# EasyEDA Pro project ProDoc_OHPP-004_Joule_Scope.epro

# Board OHPP-004
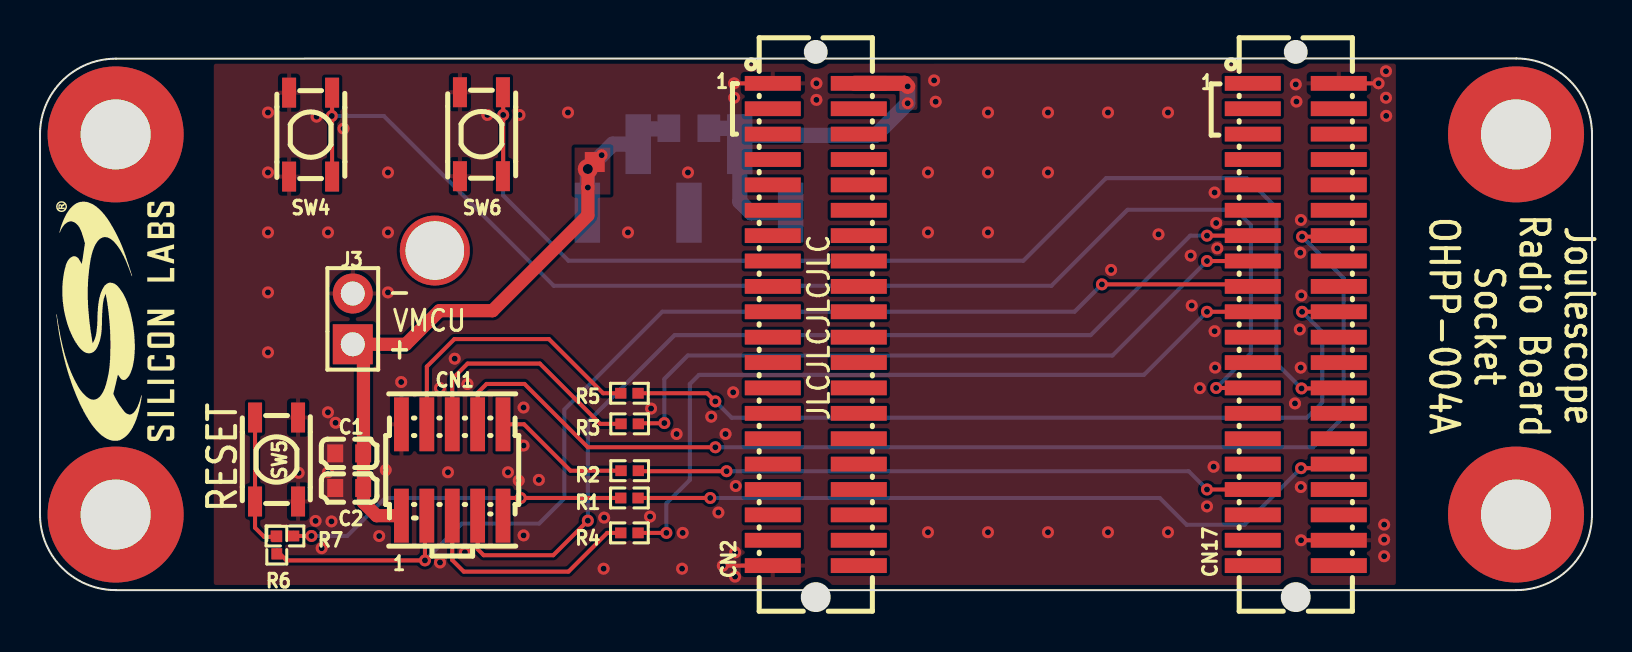
[diagram p0: board, top side]
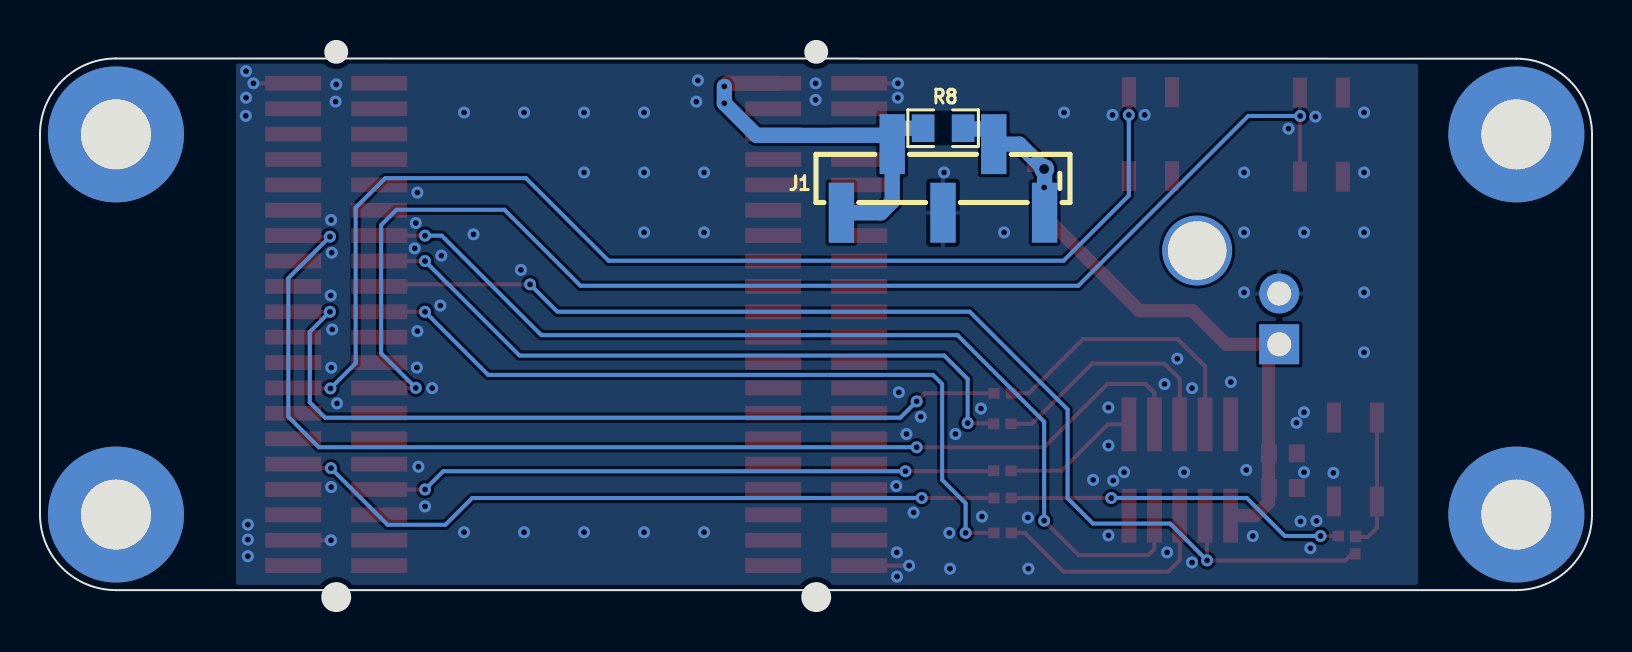
[diagram p1: board, bottom side, seen from below]

Outline 77.6 x 28.62 mm; copper layers: Top Layer, Bottom Layer. Coordinates in mm from the lower left corner of the outline.
Outline path: 0,23.9 0,4.89 arc(1.11,2.21) 3.79,1.1 73.81,1.1 arc(76.49,2.21) 77.6,4.89 77.6,23.91 arc(76.49,26.59) 73.81,27.7 3.79,27.69 arc(1.11,26.58) 0,23.9
Stack: Top Layer 0.035mm / Dielectric1 1.51mm FR4 er 4.5 / Bottom Layer 0.035mm

## Design rules (mm)
template: User Custom Config
spacing safeClearance (default): track to track 0.152, other pairs 0 to 0.3
spacing GND: track to track 0.127, other pairs 0.127 to 0.127
track width trackWidth (default): min 0.203, default 0.203, max 0.762
differential pair differentialPair (default): width min 0.127, default 0.254, max 2.54; gap min 0.152, default 0.152
via viaSize (default): diameter min 0.6, default 0.6, max 1; hole min 0.3, default 0.3, max 0.5
net POWER_GND uses GND
pour ie1304 uses CopperRegion

## Placement (name value [footprint] x y rotation side)
C1  10uF  [C0603]  15.46 7.94 0 top
C2  100nF  [C0603]  15.46 6.2 0 top
CN1  2c2c0cbd1279413883296d3c65cb7f58  [IDC-SMD_3132-10MG0BK00R2_1]  20.61 7.11 0 top
CN2  3131-40MG0BK00T2  [CONN-SMD_40P-P1.27_WCON_3131-40MG0BK00T2]  38.79 14.39 90 top
CN17  3131-40MG0BK00T2  [CONN-SMD_40P-P1.27_WCON_3131-40MG0BK00T2]  62.79 14.39 90 top
H1  -  [HOLE_D3M5_D7M0_PAD_PTH]  73.81 4.88 0 top
H2  -  [HOLE_D3M5_D7M0_PAD_PTH]  73.8 23.9 0 top
H3  -  [HOLE_D3M5_D7M0_PAD_PTH]  3.78 23.9 0 top
H4  -  [HOLE_D3M5_D7M0_PAD_PTH]  3.78 4.88 0 top
J1  54201-S08-05ALF  [CONN-SMD_54201-S08-05ALF]  32.45 21.69 0 bottom
J3  KH-2.54PH180-1X2P-L11.5  [HDR-TH_2P-P2.54-V-M]  15.64 14.67 90 top
NOREF  -  [Pad_ie447]  19.74 18.09 180 top
NOREF#2  -  [Pad_e432]  27.74 22.51 0 top
R1  0Ω  [R0402]  29.47 5.71 180 top
R2  0Ω  [R0402]  29.48 7.07 180 top
R3  0Ω  [R0402]  29.48 9.42 180 top
R4  0Ω  [R0402]  29.47 3.96 180 top
R5  0Ω  [R0402]  29.47 10.95 180 top
R6  0Ω  [R0402]  11.84 3.35 90 top
R7  0Ω  [R0402]  12.25 3.81 180 top
R8  0Ω  [R0805]  32.44 24.21 180 bottom
SW4  TS-1101-J26  [SW-SMD_4P-L4.2-W3.4-P2.15-LS4.5-BL]  13.53 23.89 270 top
SW5  TS-1101-J26  [SW-SMD_4P-L4.2-W3.4-P2.15-LS4.5-BL]  11.83 7.63 90 top
SW6  TS-1101-J26  [SW-SMD_4P-L4.2-W3.4-P2.15-LS4.5-BL]  22.07 23.91 270 top

## Footprints (pads in the part's own frame, mm; a bottom-side part is the same pattern mirrored in y, then rotated)
C0603
  rect 0.8x0.9 smd: 1(-0.7,0) 2(0.7,0)
CONN-SMD_40P-P1.27_WCON_3131-40MG0BK00T2
  rect 0.74x2.8 smd: 1(12.065,2.15) 2(12.065,-2.15) 3(10.795,2.15) 4(10.795,-2.15) 5(9.525,2.15) 6(9.525,-2.15) 7(8.255,2.15) 8(8.255,-2.15) 9(6.985,2.15) 10(6.985,-2.15) 11(5.715,2.15) 12(5.715,-2.15) 13(4.445,2.15) 14(4.445,-2.15) 15(3.175,2.15) 16(3.175,-2.15) 17(1.905,2.15) 18(1.905,-2.15) 19(0.635,2.15) 20(0.635,-2.15) 21(-0.635,2.15) 22(-0.635,-2.15) 23(-1.905,2.15) 24(-1.905,-2.15) 25(-3.175,2.15) 26(-3.175,-2.15) 27(-4.445,2.15) 28(-4.445,-2.15) 29(-5.715,2.15) 30(-5.715,-2.15) 31(-6.985,2.15) 32(-6.985,-2.15) 33(-8.255,2.15) 34(-8.255,-2.15) 35(-9.525,2.15) 36(-9.525,-2.15) 37(-10.795,2.15) 38(-10.795,-2.15) 39(-12.065,2.15) 40(-12.065,-2.15)
CONN-SMD_54201-S08-05ALF
  rect 1.27x3 smd: 1(-5.08,1.715) 2(-2.54,-1.715) 3(0,1.715) 4(2.54,-1.715) 5(5.08,1.715)
HDR-TH_2P-P2.54-V-M
  rect 2x2 hole 1.2: 1(-1.27,0)
  round 2 hole 1.2: 2(1.27,0)
HOLE_D3M5_D7M0_PAD_PTH
  round 6.8 hole 3.5: 1(0,0)
IDC-SMD_3132-10MG0BK00R2_1
  rect 0.74x2.7 smd: 1(-2.54,-2.286) 2(-2.54,2.286) 3(-1.27,-2.286) 4(-1.27,2.286) 5(0,-2.286) 6(0,2.286) 7(1.27,-2.286) 8(1.27,2.286) 9(2.54,-2.286) 10(2.54,2.286)
Pad_e432
  rect 1x1 smd: 1(0,0)
Pad_ie447
  round 3.5 hole 2.93: (0,0)
R0402
  rect 0.566x0.54 smd: 1(-0.433,0) 2(0.433,0)
R0805
  rect 1.133x1.377 smd: 1(-1,0) 2(1,0)
SW-SMD_4P-L4.2-W3.4-P2.15-LS4.5-BL
  rect 1.5x0.7 smd: 1(-2.1,-1.075) 2(2.1,-1.075) 3(-2.1,1.075) 4(2.1,1.075)

## Nets
EXT_IN: C1.2 C2.2 CN1.1 J1.1 J1.2 J3.1 NOREF#2.1 R8.2
EXT_OUT: CN2.2 J1.4 J1.5 R8.1
POWER_GND: C1.1 C2.1 CN1.2 CN2.1 CN2.39 CN17.2 CN17.38 J1.3 J3.2 SW4.1 SW4.2 SW5.1 SW5.2 SW6.1 SW6.2
$1N1: CN17.32 R1.1
$1N2: CN1.9 R1.2 R7.1
$1N3: CN17.26 SW6.3 SW6.4
$1N4: CN1.6 R3.2
$1N6: CN17.20 R5.1
$1N9: CN1.4 R5.2
$1N10: CN17.15 R3.1
$1N11: CN17.19 R4.1
$1N12: CN1.7 CN17.13
$1N13: CN17.33 R2.1
$1N14: CN1.8 CN17.14
$1N18: CN17.25 SW4.3 SW4.4
$1N22: CN1.10 R2.2
$1N23: CN1.3 CN17.17 R6.1
$1N31: CN1.5 R4.2
$1N4211: R6.2 R7.2 SW5.3 SW5.4

Pads without a net: CN2 3 4 5 6 7 8 9 10 11 12 13 14 15 16 17 18 19 20 21 22 23 24 25 26 27 28 29 30 31 32 33 34 35 36 37 38 40; CN17 1 3 4 5 6 7 8 9 10 11 12 16 18 21 22 23 24 27 28 29 30 31 34 35 36 37 39 40; H1 1; H2 1; H3 1; H4 1

## Via types
v1: diameter 0.6, hole 0.3, Top Layer to Bottom Layer, 128 vias
v2: diameter 1, hole 0.5, Top Layer to Bottom Layer, 1 via

## Routing (per net, layer and track width the routed paths; a pad name or vN(x,y) marks a point on that pad's centre or on a via; arc(x,y) is an arc through that point)
EXT_IN: length 34.4
  Top Layer w0.66: v2(27.39,22.17) v1(27.39,21.24) 27.39,19.84 22.63,15.08 19.97,15.08 18.29,13.4 J3.1 16.17,12.86 16.17,5.48 16.83,4.82 CN1.1
  Bottom Layer w0.762: R8.2 31.41,24.17 30.17,24.17 29.91,23.91 J1.2 28.63,23.41 v1(28.08,22.86) v2(27.39,22.17) 27.37,22.14 J1.1
EXT_OUT: length 20.8
  Top Layer w0.762: 40.74,26.45 43.23,26.45 v1(43.38,26.3)
  Bottom Layer w0.762: R8.1 34.94,24.21 34.99,24.16 J1.4 ; J1.4 34.99,20.54 35.56,19.97 37.52,19.97 J1.5 ; J1.4 35.43,23.85 41.78,23.85 v1(43.38,25.46) v1(43.38,26.3)
POWER_GND: length 8.7
  Top Layer w0.203: 64.74,26.45 v1(66.93,26.45) ; 64.74,3.59 v1(63.05,3.59) ; 36.84,2.32 v1(34.14,2.32) ; 36.84,26.45 v1(34.7,26.45)
  vias: v1(11.4,24.99) v1(11.4,21.99) v1(11.4,18.99) v1(11.4,15.99) v1(11.4,12.99) v1(12.93,6.96) v1(13.83,24.78) v1(13.78,4.56) v1(14.08,3.19) v1(14.4,18.99) v1(14.4,9.99) v1(14.4,6.99) v1(14.57,4.53) v1(14.78,9.47) v1(15.18,24.19) v1(16.96,3.8) v1(17.29,7.11) v1(17.4,21.99) v1(17.4,18.99) v1(17.4,15.99) v1(18.06,11.51) v1(20,11.2) v1(20,2.48) v1(20.4,6.99) v1(20.74,12.68) v1(21.25,2.98) v1(21.37,11.41) v1(22.37,24.87) v1(23.4,6.99) v1(23.94,6.57) v1(23.97,24.87) v1(24.18,10.23) v1(24.18,8.33) v1(24.18,3.83) v1(24.94,6.61) v1(26.4,24.99) v1(28.21,4.72) v1(28.18,2.17) v1(29.4,18.99) v1(30.5,4.78) v1(30.55,10.18) v1(31.83,8.91) v1(32.13,3.96) v1(32.1,2.17) v1(32.4,21.99) v1(33.56,9.77) v1(33.92,4.98) v1(34.28,8.91) v1(34.71,25.73) v1(34.66,10.99) v1(34.79,6.31) v1(34.76,2.98) v1(34.75,1.77) v1(38.82,26.45) v1(38.82,25.62) v1(44.4,21.99) v1(44.4,18.99) v1(44.4,3.99) v1(44.71,26.6) v1(44.78,25.53) v1(47.4,24.99) v1(47.4,21.99) v1(47.4,18.99) v1(47.4,3.99) v1(50.4,24.99) v1(50.4,21.99) v1(50.4,3.99) v1(53.4,24.99) v1(53.4,3.99) v1(53.56,17.12) v1(55.93,18.9) v1(56.4,24.99) v1(56.4,3.99) v1(57.53,17.83) v1(57.58,15.33) v1(57.99,11.2) v1(58.35,5.29) v1(58.73,20.99) v1(58.73,14.05) v1(58.68,7.27) v1(58.81,19.46) v1(58.76,12.23) v1(58.86,18.2) v1(62.79,26.4) v1(62.82,25.54) v1(62.75,10.44) v1(63.01,17.98) v1(62.99,14.14) v1(63.04,12.23) v1(63.04,6.25) v1(63.04,19.62) v1(63.07,15.84) v1(67.21,4.37) v1(67.21,3.62) v1(67.21,2.79) v1(67.3,27.06) v1(67.3,25.73) v1(67.31,24.82)
$1N1: length 36.7
  Top Layer w0.203: 64.74,7.4 64.54,7.2 v1(63.05,7.2) ; R1.1 v1(33.51,5.71)
  Bottom Layer w0.203: v1(63.05,7.2) 60.22,4.37 57.33,4.37 55.99,5.71 v1(33.51,5.71)
$1N2: length 18.9
  Top Layer w0.203: v1(13.57,3.81) 12.83,3.81 12.68,3.96 ; R1.2 v1(24.04,5.71) 23.37,5.71 23.15,5.49 CN1.9
  Bottom Layer w0.203: v1(13.57,3.81) 15.36,3.81 17.26,5.71 v1(24.04,5.71)
$1N3: length 61.8
  Top Layer w0.203: SW6.3 23.16,25.99 v1(23.16,24.87) 23.16,21.82 SW6.4 ; v1(63.08,11.19) 64.72,11.19 64.74,11.21
  Bottom Layer w0.203: v1(63.08,11.19) 61.82,12.45 61.82,20.23 60.34,21.71 53.3,21.71 49.17,17.58 26.42,17.58 23.16,20.84 v1(23.16,24.87)
$1N4: length 12.3
  Top Layer w0.203: CN1.6 20.61,11.66 21.38,12.43 24.99,12.43 28,9.42 R3.2
$1N6: length 41.6
  Top Layer w0.203: 64.74,15.02 v1(63.1,15.02) ; v1(33.77,10.54) 33.36,10.95 R5.1
  Bottom Layer w0.203: v1(63.1,15.02) 64.11,14.01 64.11,10.49 63.35,9.72 34.58,9.72 v1(33.77,10.54)
$1N9: length 14.3
  Top Layer w0.203: CN1.4 19.34,12.28 20.72,13.66 25.45,13.66 28.16,10.95 R5.2
$1N10: length 35.6
  Top Layer w0.203: 60.84,17.56 v1(58.35,17.56) ; v1(31.22,9.45) 31.21,9.44 29.94,9.44 R3.1
  Bottom Layer w0.203: v1(31.22,9.45) 31.22,11.66 32.39,12.83 53.62,12.83 v1(58.35,17.56)
$1N11: length 39.2
  Top Layer w0.203: 60.84,15.02 v1(58.35,15.02) ; R4.1 v1(31.32,3.96)
  Bottom Layer w0.203: v1(31.32,3.96) 31.32,5.44 32.49,6.61 32.49,11.41 32.95,11.86 55.19,11.86 v1(58.35,15.02)
$1N12: length 50.3
  Top Layer w0.203: 60.84,18.83 v1(58.35,18.83) ; CN1.7 21.88,3.14 22.18,2.84 25.66,2.84 v1(27.39,4.57)
  Bottom Layer w0.203: v1(58.35,18.83) 57.51,18.83 52.54,13.85 31.73,13.85 27.39,9.52 v1(27.39,4.57)
$1N13: length 31.4
  Top Layer w0.203: 29.92,7.17 30.04,7.04 v1(34.33,7.04) ; 60.84,6.13 v1(58.35,6.13)
  Bottom Layer w0.203: v1(34.33,7.04) 57.44,7.04 v1(58.35,6.13)
$1N14: length 58.5
  Top Layer w0.203: CN1.8 21.88,10.97 22.33,11.41 24.22,11.41 27.39,8.24 v1(33.77,8.24) ; v1(63.1,18.78) 64.69,18.78 64.74,18.83
  Bottom Layer w0.203: v1(33.77,8.24) 63.65,8.24 65.18,9.77 65.18,16.7 v1(63.1,18.78)
$1N18: length 66.5
  Top Layer w0.203: 60.84,11.21 v1(58.81,11.21) ; SW4.4 14.6,24.8 v1(14.59,24.82) 14.6,24.83 SW4.3
  Bottom Layer w0.203: v1(14.59,24.82) 17.19,24.82 25.69,16.32 50.57,16.32 54.38,20.13 59.78,20.13 60.54,19.36 60.54,12.95 v1(58.81,11.21)
$1N22: length 6.9
  Top Layer w0.203: 29.05,7.17 28.95,7.07 26.53,7.07 24.2,9.39 CN1.10
$1N23: length 59.8
  Top Layer w0.203: v1(53.1,16.39) 60.74,16.39 60.84,16.29 ; 11.84,3.07 12.32,2.58 v1(19.25,2.58) 19.25,4.73 CN1.3
  Bottom Layer w0.203: v1(19.25,2.58) 21.09,4.42 24.95,4.42 26.22,5.69 26.22,10.13 31.12,15.03 51.73,15.03 v1(53.1,16.39)
$1N31: length 11.7
  Top Layer w0.203: R4.2 28.36,3.96 26.42,2.02 21.19,2.02 20.61,2.6 CN1.5
$1N4211: length 6.9
  Top Layer w0.203: 11.84,3.93 11.67,3.76 11.21,3.76 10.75,4.22 SW5.3 SW5.4

## Copper pours and planes (outline as drawn; the poured copper is in the pictures)
EXT_IN on Top Layer: 26.73,23.24 28.52,23.24 28.52,20.89 26.73,20.89
EXT_OUT on Top Layer: 42.95,26.81 43.87,26.81 43.87,25.12 42.95,25.12
POWER_GND on Top Layer: 67.79,0.93 8.69,0.93 8.69,27.53 67.79,27.53
POWER_GND on Bottom Layer: 67.8,1.09 8.7,1.09 8.7,27.69 67.8,27.69

## Text on the board
Document Layer: JS110 Joulescope Front Panel Radio Board Adapter / Baseline Layout
Top Silkscreen Layer: 1 | VMCU | JLCJLCJLCJLC | - | + | RESET | Joulescope / Radio Board / Socket / OHPP-004A
